# EAGLE design master (EAGLE 6.6.0)
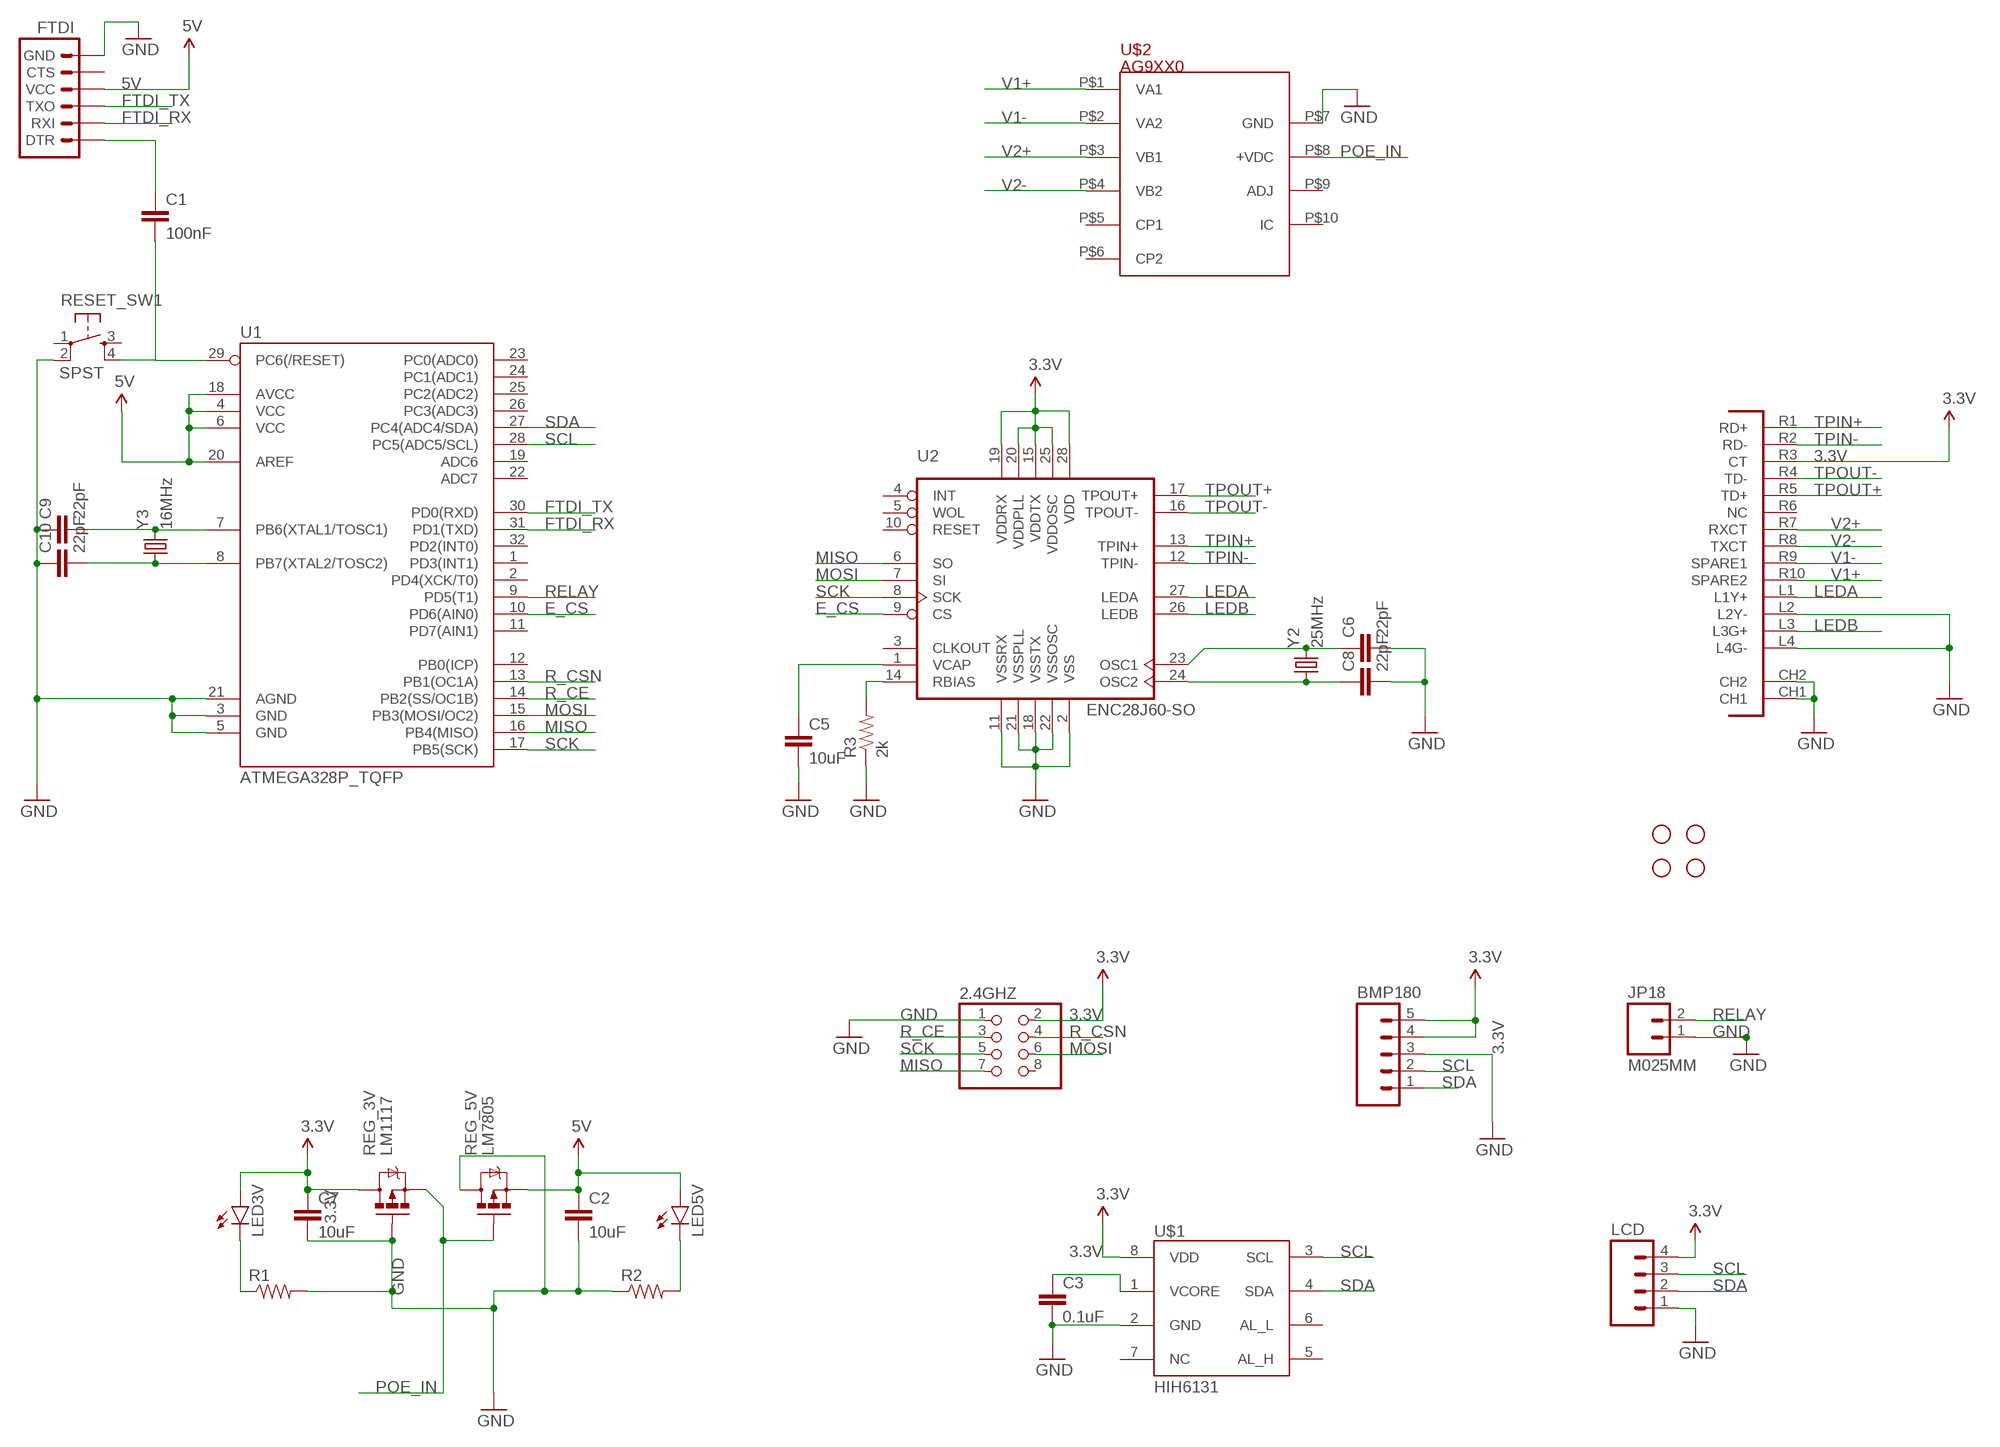
[diagram p0: schematic, sheet 1]

## Parts
2.4GHZ  PINHD-2X4  [2X04]
BMP180  M05PTH  [1X05]
C1  100nF  CAPPTH  [CAP-PTH-SMALL]
C2  10uF  CAPPTH  [CAP-PTH-SMALL]
C3  0.1uF  CAPPTH  [CAP-PTH-SMALL]
C5  10uF  CAPPTH  [CAP-PTH-SMALL]
C6  22pF  CAPPTH  [CAP-PTH-SMALL]
C7  10uF  CAPPTH  [CAP-PTH-SMALL]
C8  22pF  CAPPTH  [CAP-PTH-SMALL]
C9  22pF  CAPPTH  [CAP-PTH-SMALL]
C10  22pF  CAPPTH  [CAP-PTH-SMALL]
FTDI  ARDUINO_SERIAL_PROGRAMPTH  [1X06]
JP18  M025MM  [SCREWTERMINAL-5MM-2]
LCD  M04PTH  [1X04]
LED3V  LED3MM  [LED3MM]
LED5V  LED3MM  [LED3MM]
R1  RESISTORPTH-1/4W-VERT  [AXIAL-0.1]
R2  RESISTORPTH-1/4W-VERT  [AXIAL-0.1]
R3  2k  RESISTORPTH-1/4W-VERT  [AXIAL-0.1]
REG_3V  LM1117  MOSFET-PCHANNELFQP27P06  [TO220V]
REG_5V  LM7805  MOSFET-PCHANNELFQP27P06  [TO220V]
RESET_SW1  SPST  TACTILE-SWITCH-PTH  [TAC-SWITCH-PTH]
STANDOFF1  STAND-OFF  [STAND-OFF]
STANDOFF2  STAND-OFF  [STAND-OFF]
STANDOFF3  STAND-OFF  [STAND-OFF]
STANDOFF4  STAND-OFF  [STAND-OFF]
U1  ATMEGA328P_TQFP  [TQFP32-08]
U2  ENC28J60-SO  [SO28W]
U$1  HIH6131  [SOIC8]
U$2  AG9XX0  [AG9000]
U$3  POE-RJ45  [POE-RJ45]
Y2  25MHz  CRYSTALHC49US  [HC49US]
Y3  16MHz  CRYSTALHC49US  [HC49US]

## Nets
3.3V: 2.4GHZ.2 BMP180.4 BMP180.5 C7.1 LCD.4 LED3V.A REG_3V.2(D) U2.15(VDDTX) U2.19(VDDRX) U2.20(VDDPLL) U2.25(VDDOSC) U2.28(VDD) U$1.8(VDD) U$3.R3(CT)
5V: C2.1 FTDI.4(VCC) LED5V.A REG_5V.3(S) U1.4(VCC) U1.6(VCC) U1.18(AVCC) U1.20(AREF)
E_CS: U1.10(PD6(AIN0)) U2.9(CS)
FTDI_RX: FTDI.2(RXI) U1.31(PD1(TXD))
FTDI_TX: FTDI.3(TXO) U1.30(PD0(RXD))
GND: 2.4GHZ.1 BMP180.3 C2.2 C3.2 C5.2 C6.2 C7.2 C8.2 C9.1 C10.1 FTDI.6(GND) JP18.1 LCD.1 R1.P$2 R2.P$1 R3.P$1 REG_3V.1(G) REG_5V.2(D) RESET_SW1.2 U1.3(GND) U1.5(GND) U1.21(AGND) U2.2(VSS) U2.11(VSSRX) U2.18(VSSTX) U2.21(VSSPLL) U2.22(VSSOSC) U$1.2(GND) U$2.P$7(GND) U$3.CH1 U$3.CH2 U$3.L2(L2Y-) U$3.L4(L4G-)
LEDA: U2.27(LEDA) U$3.L1(L1Y+)
LEDB: U2.26(LEDB) U$3.L3(L3G+)
MISO: 2.4GHZ.7 U1.16(PB4(MISO)) U2.6(SO)
MOSI: 2.4GHZ.6 U1.15(PB3(MOSI/OC2)) U2.7(SI)
N$1: LED3V.K(C) R1.P$1
N$2: LED5V.K(C) R2.P$2
N$3: R3.P$2 U2.14(RBIAS)
N$4: C5.1 U2.1(VCAP)
N$5: C6.1 U2.23(OSC1) Y2.2
N$6: C8.1 U2.24(OSC2) Y2.1
N$17: C3.1 U$1.1(VCORE)
N$20: C9.2 U1.7(PB6(XTAL1/TOSC1)) Y3.2
N$21: C10.2 U1.8(PB7(XTAL2/TOSC2)) Y3.1
N$37: C1.1 FTDI.1(DTR)
POE_IN: REG_3V.3(S) REG_5V.1(G) U$2.P$8(+VDC)
R_CE: 2.4GHZ.3 U1.14(PB2(SS/OC1B))
R_CSN: 2.4GHZ.4 U1.13(PB1(OC1A))
RELAY: JP18.2 U1.9(PD5(T1))
RESET: C1.2 RESET_SW1.4 U1.29(PC6(/RESET))
SCK: 2.4GHZ.5 U1.17(PB5(SCK)) U2.8(SCK)
SCL: BMP180.2 LCD.3 U1.28(PC5(ADC5/SCL)) U$1.3(SCL)
SDA: BMP180.1 LCD.2 U1.27(PC4(ADC4/SDA)) U$1.4(SDA)
TPIN+: U2.13(TPIN+) U$3.R1(RD+)
TPIN-: U2.12(TPIN-) U$3.R2(RD-)
TPOUT+: U2.17(TPOUT+) U$3.R5(TD+)
TPOUT-: U2.16(TPOUT-) U$3.R4(TD-)
V1+: U$2.P$1(VA1) U$3.R10(SPARE2)
V1-: U$2.P$2(VA2) U$3.R9(SPARE1)
V2+: U$2.P$3(VB1) U$3.R7(RXCT)
V2-: U$2.P$4(VB2) U$3.R8(TXCT)
Unconnected: 2.4GHZ.8 FTDI.5(CTS) RESET_SW1.1 RESET_SW1.3 U1.1(PD3(INT1)) U1.2(PD4(XCK/T0)) U1.11(PD7(AIN1)) U1.12(PB0(ICP)) U1.19(ADC6) U1.22(ADC7) U1.23(PC0(ADC0)) U1.24(PC1(ADC1)) U1.25(PC2(ADC2)) U1.26(PC3(ADC3)) U1.32(PD2(INT0)) U2.3(CLKOUT) U2.4(INT) U2.5(WOL) U2.10(RESET) U$1.5(AL_H) U$1.6(AL_L) U$1.7(NC) U$2.P$5(CP1) U$2.P$6(CP2) U$2.P$9(ADJ) U$2.P$10(IC) U$3.R6(NC)

## Library data of the parts
2.4GHZ = adafruit:PINHD-2X4: PIN HEADER
BMP180 = SparkFun-Connectors:M05: Header 5 Standard 5-pin 0.1" header. Use with straight break away headers (SKU : PRT-00116), right angle break away headers (PRT-00553), swiss pins (PRT-00743), machine pins (PRT-00117), and female headers (PRT-00115). Molex polarized connector foot print use with SKU : PRT-08230 with associated crimp pins and housings.
C1-C3 C5-C10 = SparkFun-Capacitors:CAP: Capacitor Standard 0603 ceramic capacitor, and 0.1" leaded capacitor.
FTDI = SparkFun-Connectors:ARDUINO_SERIAL_PROGRAM: FTDI connector footprints
JP18 = SparkFun-Connectors:M02: Standard 2-pin 0.1" header. Use with - straight break away headers ( PRT-00116) - right angle break away headers (PRT-00553) - swiss pins (PRT-00743) - machine pins (PRT-00117) - female headers (PRT-00115) Molex polarized connector foot print use with: PRT-08233 with associated crimp pins and housings. 2.54_SCREWTERM for use with PRT-10571. 3.5mm Screw Terminal footprints for PRT-08084 5mm Screw Terminal footprints for use with PRT-08432; STOREFRONT_ID: PRT-08432
LCD = SparkFun-Connectors:M04: Header 4 Standard 4-pin 0.1" header. Use with straight break away headers (SKU : PRT-00116), right angle break away headers (PRT-00553), swiss pins (PRT-00743), machine pins (PRT-00117), and female headers (PRT-00115). Molex polarized connector foot print use with SKU : PRT-08231 with associated crimp pins and housings. 1MM SMD Version SKU: PRT-10208
LED3V LED5V = SparkFun-LED:LED: LEDs Standard schematic elements and footprints for 5mm, 3mm, 1206, and 0603 sized LEDs. 5mm - Spark Fun Electronics SKU : COM-00529 (and others)
R1-R3 = SparkFun-Resistors:RESISTOR: Resistor Basic schematic elements and footprints for 0603, 1206, and PTH resistors.
REG_3V REG_5V = User-Submitted:MOSFET-PCHANNEL: Generic PMOSFET IRLML2244 - TRANS-11153 (SOT-23 -20V -4.3A) (1.Gate 2.Source 3.Drain) FQP27P06 - COM-10349 <http://www.sparkfun.com/products/10349> (TO-220 -60V -27A) (1.Gate 2.Source 3.Drain)
RESET_SW1 = GeekAmmo:TACTILE-SWITCH: Tactile Switch 4 Pins, SPST NO
STANDOFF1-STANDOFF4 = SparkFun-Electromechanical:STAND-OFF: #4 Stand Off This is the mechanical footprint for a #4 phillips button head screw. Use the keepout ring to avoid running the screw head into surrounding components. SKU : PRT-00447
U1 = SparkFun-DigitalIC:ATMEGA328P_TQFP; PROD_ID: IC-09069
U2 = microchip-enc28j60:ENC28J60-*: Microchip 10Mbit Eth. contoller with SPI interface
U$1 = SparkFun-AnalogIC:HIH6131
U$2 = SmartPrj:AG9XX0: PoE module
U$3 = SmartPrj:POE-RJ45
Y2 Y3 = SparkFun-FreqCtrl:CRYSTAL: Various standard crystals. Proven footprints.

## Board
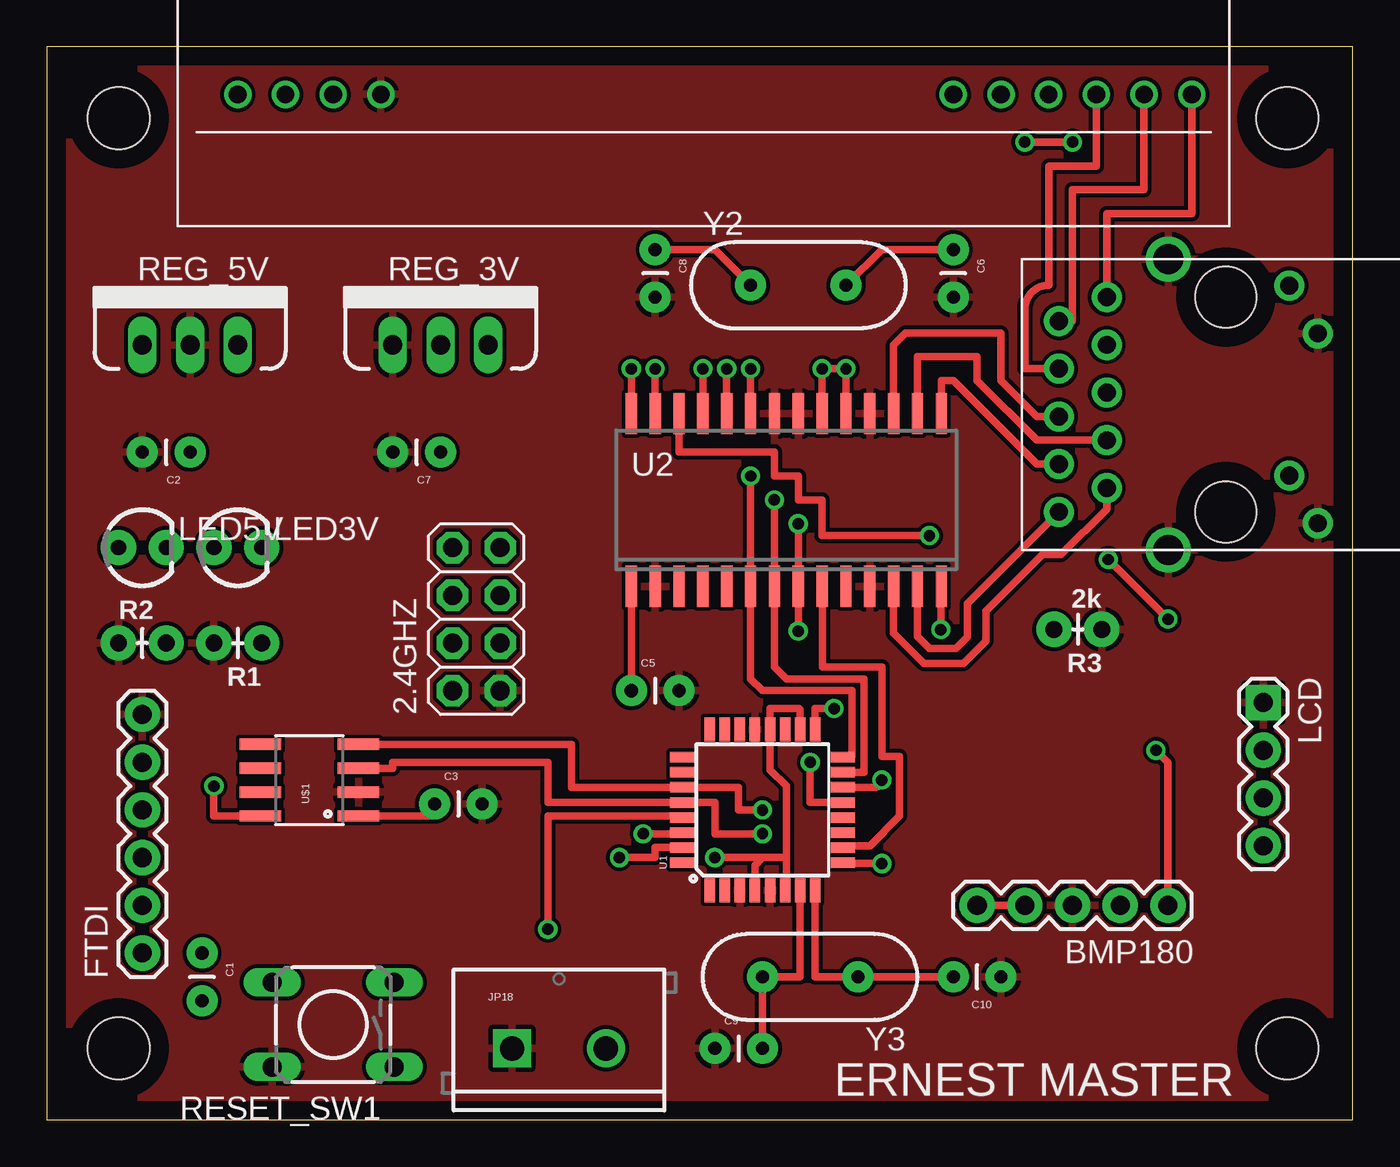
[diagram p1: board, top side]
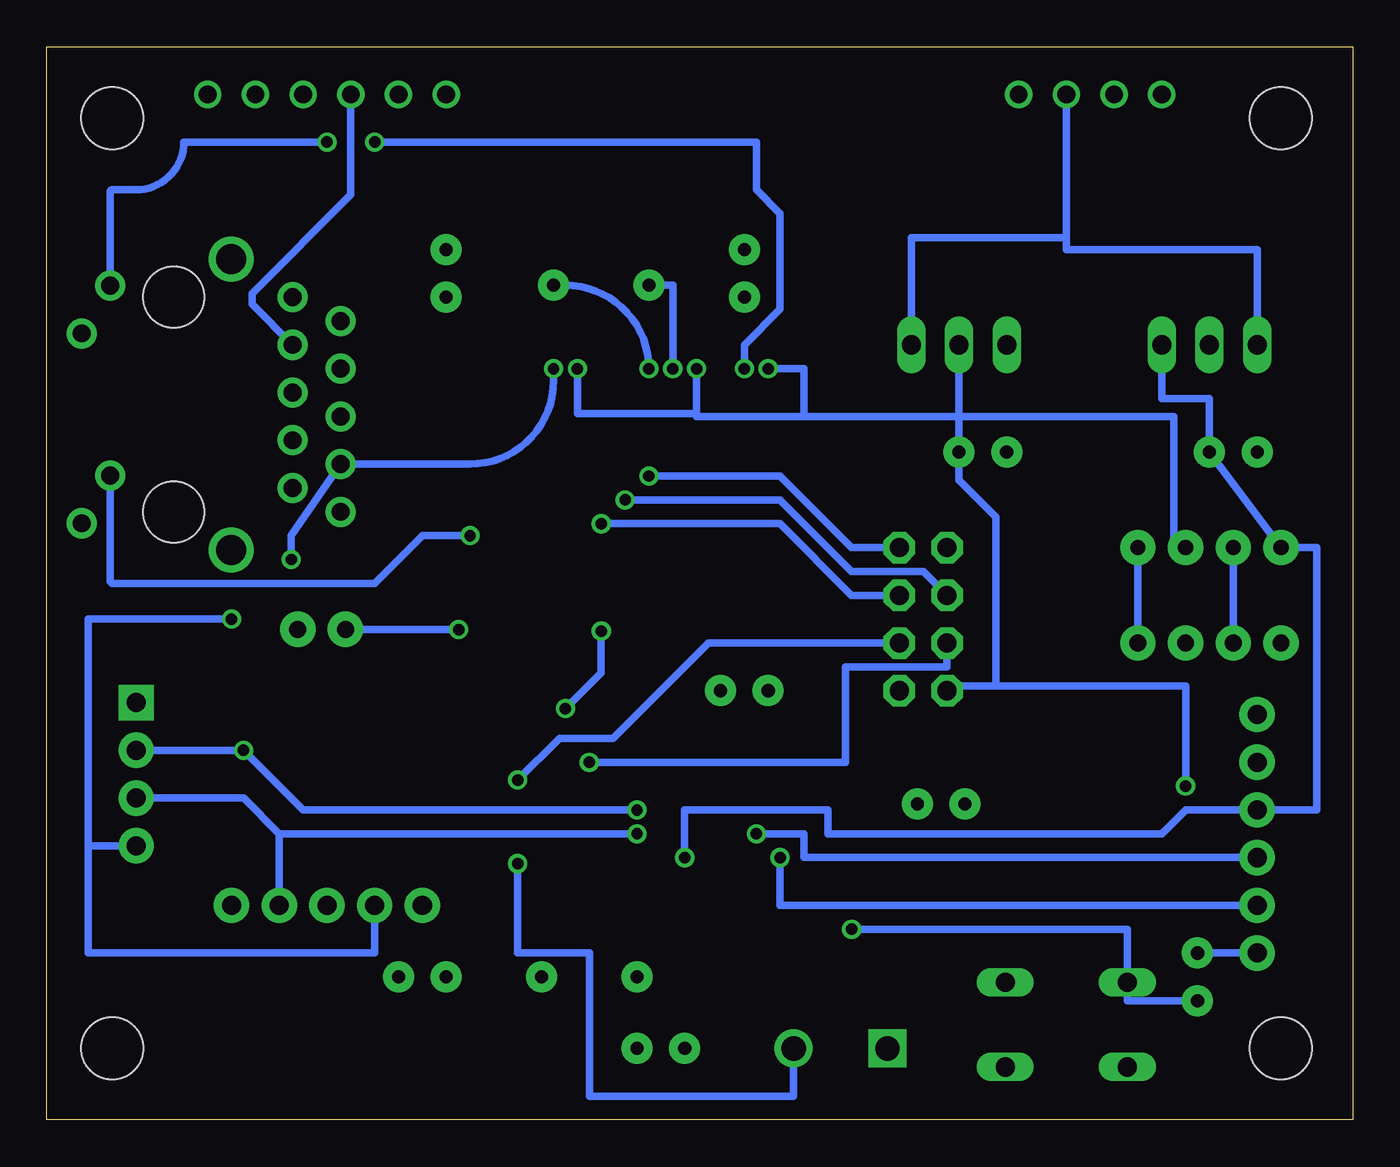
[diagram p2: board, bottom side, seen from below]

Size 69.52 x 57.14 mm. Coordinates in mm from the lower left corner, seen from the top.
Outline: 0,0 69.52,0 69.52,57.14 0,57.14 0,0
Copper layers (1*16): Top 0.035mm / dielectric 1.5mm / Bottom 0.035mm
Design rules "default": minimum track width 10mil, minimum drill 24mil, track to track 8mil, track to pad 8mil, pad to pad 8mil, via to via 8mil, smd to smd 8mil, copper to edge 40mil, drill to drill 8mil, minimum pad ring 10mil, minimum via ring 8mil, stop-mask expansion 4mil, vias tented up to drill 0mil, thermal gap 10mil

### Footprints (pad centres in the part's own frame; a part is rotated, then mirrored left to right if it is on the bottom)
2X04 = drill 1.016 pad 1.676 octagon: 1 -3.81,-1.27; 2 -3.81,1.27; 3 -1.27,-1.27; 4 -1.27,1.27; 5 1.27,-1.27; 6 1.27,1.27; 7 3.81,-1.27; 8 3.81,1.27
1X05 = drill 1.016 pad 1.88: 1 0,0; 2 2.54,0; 3 5.08,0; 4 7.62,0; 5 10.16,0
CAP-PTH-SMALL = drill 0.7 pad 1.651: 1 0,0; 2 2.54,0
1X06 = drill 1.016 pad 1.88: 1 0,0; 2 2.54,0; 3 5.08,0; 4 7.62,0; 5 10.16,0; 6 12.7,0
SCREWTERMINAL-5MM-2 = drill 1.3 pad 2.032 square: 1 0,0 | drill 1.3 pad 2.032: 2 5,0
1X04 = drill 1.016 pad 1.88 square: 1 0,0 | drill 1.016 pad 1.88: 2 2.54,0; 3 5.08,0; 4 7.62,0
LED3MM = drill 0.813 pad 1.88: A -1.27,0; K 1.27,0
AXIAL-0.1 = drill 0.9 pad 1.88: P$1 0,0; P$2 2.54,0
TO220V = drill 1.016 long: 1 -2.54,0; 2 0,0; 3 2.54,0
TAC-SWITCH-PTH = drill 1.016 pad 1.524 long: 1 -3.251,2.261; 2 3.251,2.261; 3 -3.251,-2.261; 4 3.251,-2.261
STAND-OFF = hole 3.302: 0,0
TQFP32-08 = smd 1.27 x 0.559: 1 -4.293,2.8; 2 -4.293,2; 3 -4.293,1.2; 4 -4.293,0.4; 5 -4.293,-0.4; 6 -4.293,-1.2; 7 -4.293,-2; 8 -4.293,-2.8; 17 4.293,-2.8; 18 4.293,-2; 19 4.293,-1.2; 20 4.293,-0.4; 21 4.293,0.4; 22 4.293,1.2; 23 4.293,2; 24 4.293,2.8 | smd 0.559 x 1.27: 9 -2.8,-4.293; 10 -2,-4.293; 11 -1.2,-4.293; 12 -0.4,-4.293; 13 0.4,-4.293; 14 1.2,-4.293; 15 2,-4.293; 16 2.8,-4.293; 25 2.8,4.293; 26 2,4.293; 27 1.2,4.293; 28 0.4,4.293; 29 -0.4,4.293; 30 -1.2,4.293; 31 -2,4.293; 32 -2.8,4.293
SO28W = smd 0.6 x 2.2: 1 -8.255,-4.6; 2 -6.985,-4.6; 3 -5.715,-4.6; 4 -4.445,-4.6; 5 -3.175,-4.6; 6 -1.905,-4.6; 7 -0.635,-4.6; 8 0.635,-4.6; 9 1.905,-4.6; 10 3.175,-4.6; 11 4.445,-4.6; 12 5.715,-4.6; 13 6.985,-4.6; 14 8.255,-4.6; 15 8.255,4.6; 16 6.985,4.6; 17 5.715,4.6; 18 4.445,4.6; 19 3.175,4.6; 20 1.905,4.6; 21 0.635,4.6; 22 -0.635,4.6; 23 -1.905,4.6; 24 -3.175,4.6; 25 -4.445,4.6; 26 -5.715,4.6; 27 -6.985,4.6; 28 -8.255,4.6
SOIC8 = smd 0.61 x 2.21: 1 -1.905,-2.616; 2 -0.635,-2.616; 3 0.635,-2.616; 4 1.905,-2.616; 5 1.905,2.616; 6 0.635,2.616; 7 -0.635,2.616; 8 -1.905,2.616
AG9000 = drill 0.95 pad 1.422: P$1 0,0; P$2 2.54,0; P$3 5.08,0; P$4 7.62,0; P$5 10.16,0; P$6 12.7,0; P$7 43.18,0; P$8 45.72,0; P$9 48.26,0; P$10 50.8,0
POE-RJ45 = drill 1.6: CH1 13.94,7.75; CH2 13.94,-7.75 | drill 0.95 pad 1.6: L1 7.51,-6.325; L2 5.99,-3.785; L3 7.51,3.785; L4 5.99,6.325; R1 19.77,5.715; R2 17.23,4.445; R3 19.77,3.175; R4 17.23,1.905; R5 19.77,0.635; R6 17.23,-0.635; R7 19.77,-1.905; R8 17.23,-3.175; R9 19.77,-4.445; R10 17.23,-5.715 | hole 3.25: 10.89,5.715; 10.89,-5.715
HC49US = drill 0.7 pad 1.651: 1 -2.54,0; 2 2.54,0

### Placement (x,y rotation side)
2.4GHZ  22.86,26.67 90 top
BMP180  59.69,11.43 180 top
C1  8.26,8.89 270 top
C2  7.62,35.56 180 top
C3  20.64,16.83 0 top
C5  31.11,22.86 0 top
C6  48.26,46.35 270 top
C7  20.95,35.56 180 top
C8  32.38,46.35 270 top
C9  35.56,3.81 0 top
C10  50.8,7.62 180 top
FTDI  5.08,8.89 90 top
JP18  24.77,3.81 0 top
LCD  64.77,22.22 270 top
LED3V  10.16,30.48 0 top
LED5V  5.08,30.48 0 top
R1  11.43,25.4 180 top
R2  3.81,25.4 0 top
R3  56.16,26.13 180 top
REG_3V  20.95,41.27 0 top
REG_5V  7.62,41.27 0 top
RESET_SW1  15.24,5.08 180 top
STANDOFF1  3.81,53.34 0 top
STANDOFF2  3.81,3.81 0 top
STANDOFF3  66.04,3.81 0 top
STANDOFF4  66.04,53.34 0 top
U1  38.1,16.51 90 top
U2  39.37,33.02 0 top
U$1  13.97,18.1 90 top
U$2  60.96,54.61 180 top
U$3  73.66,38.1 180 top
Y2  40.01,44.45 0 top
Y3  40.64,7.62 180 top

### Tracks (layer width: path | path; a pad name or v marks a point on that pad's centre or on a via)
3.3V  (via drill 0.61)
  Top 0.406: BMP180.5 BMP180.4 | v56.52,29.84 v59.69,26.67 | U$3.R3 52.7,34.92 48.26,39.37 47.62,39.37 U2.15 | U2.28 v31.11,40.01 | U2.25 v34.92,40.01 | U2.20 v41.27,40.01 v42.55,40.01 U2.19 | U$1.8 8.89,16.19 v8.89,17.78
  Bottom 0.406: REG_3V.2 20.95,37.46 | 20.95,37.46 C7.1 20.95,34.06 19,32.11 19,23.11 | 20.95,37.46 9.53,37.46 9.53,30.48 LED3V.A | 67.31,14.61 67.31,26.67 v59.69,26.67 | 19,23.11 21.34,23.11 2.4GHZ.2 | v56.52,29.84 56.52,31.12 U$3.R3 46.99,34.92 arc-90 42.55,39.37 v42.55,40.01 | 20.95,37.46 29.21,37.46 | 29.21,37.46 29.21,40.01 v31.11,40.01 | v34.92,40.01 U2.25 | U2.25 34.92,37.46 29.21,37.46 | v41.27,40.01 U2.20 U2.25 | LCD.4 67.31,14.61 | BMP180.4 52.07,8.89 67.31,8.89 67.31,14.61 | 19,23.11 8.89,23.11 v8.89,17.78
5V  (via drill 0.61)
  Top 0.406: U1.18 40.1,21.81 arc90 40.01,21.91 38.5,21.91 U1.20 38.5,18.65 39.37,17.78 39.37,13.97 | 39.37,13.97 39.37,12.29 U1.6 | U1.4 37.7,13.57 38.1,13.97 | 38.1,13.97 39.37,13.97 | v35.56,13.97 38.1,13.97
  Bottom 0.406: v35.56,13.97 35.56,16.51 27.94,16.51 27.94,15.24 10.16,15.24 8.89,16.51 FTDI.4 1.91,16.51 1.91,30.48 LED5V.A C2.1 7.62,38.42 10.16,38.42 REG_5V.3
E_CS
  Top 0.406: U2.9 41.3,28.39 41.3,24.13 44.45,24.13 44.45,19.37 45.4,19.37 45.4,16.19 43.81,14.61 42.49,14.61 U1.10
FTDI_RX  (via drill 0.61)
  Top 0.406: U1.31 32.38,14.51 32.38,13.97 v30.48,13.97
  Bottom 0.406: FTDI.2 30.48,11.43 v30.48,13.97
FTDI_TX  (via drill 0.61)
  Top 0.406: v31.75,15.24 33.81,15.24 U1.30
  Bottom 0.406: FTDI.3 29.21,13.97 29.21,15.24 v31.75,15.24
GND
  pour Top: 0,0 69.85,0 69.85,57.15 0,57.15
LEDA  (via drill 0.61)
  Top 0.406: U2.27 v32.38,40.01 | v52.07,52.07 v54.61,52.07
  Bottom 0.406: v32.38,40.01 32.38,41.27 30.48,43.18 30.48,48.26 31.75,49.53 31.75,52.07 v52.07,52.07 | v54.61,52.07 62.23,52.07 arc90 64.77,49.53 66.04,49.53 arc-90 66.15,49.42 U$3.L1
LEDB  (via drill 0.61)
  Top 0.406: U2.26 33.66,35.56 38.73,35.56 38.73,34.29 40.01,34.29 40.01,33.02 41.27,33.02 41.27,31.12 v46.99,31.12
  Bottom 0.406: v46.99,31.12 49.53,31.12 52.07,28.58 66.04,28.58 66.15,28.69 U$3.L3
MISO  (via drill 0.61)
  Top 0.406: v37.47,34.29 U2.6 37.47,23.49 38.1,22.86 42.86,22.86 42.86,19.37 42.39,19.37 U1.16
  Bottom 0.406: 2.4GHZ.7 26.67,30.48 30.48,34.29 v37.47,34.29
MOSI  (via drill 0.61)
  Top 0.406: v38.73,33.02 U2.7 38.73,24.13 39.37,23.49 43.5,23.49 43.5,18.51 U1.15
  Bottom 0.406: 2.4GHZ.6 22.86,29.21 26.67,29.21 30.48,33.02 v38.73,33.02
N$1
  Bottom 0.406: LED3V.K R1.P$1
N$2
  Bottom 0.406: LED5V.K R2.P$2
N$3  (via drill 0.61)
  Top 0.406: U2.14 47.6,28.42 v47.6,26.11
  Bottom 0.406: v47.6,26.11 53.6,26.11 R3.P$2
N$4
  Top 0.406: C5.1 U2.1
N$5  (via drill 0.61)
  Top 0.406: C6.1 44.45,46.35 Y2.2 | v37.47,40.01 U2.23
  Bottom 0.406: Y2.2 41.91,44.45 arc90 v37.47,40.01
N$6  (via drill 0.61)
  Top 0.406: C8.1 35.56,46.35 Y2.1 | v36.2,40.01 U2.24
  Bottom 0.406: Y2.1 36.2,44.45 v36.2,40.01
N$17
  Top 0.406: U$1.1 20.64,16.19 C3.1
N$20
  Top 0.406: U1.7 40.1,7.62 Y3.2 C9.2
N$21
  Top 0.406: C10.2 Y3.1 40.9,7.62 U1.8
N$37
  Bottom 0.406: FTDI.1 C1.1
POE_IN
  Bottom 0.406: U$2.P$8 15.24,46.99 | 15.24,46.99 15.24,46.35 5.08,46.35 REG_5V.1 | REG_3V.3 23.5,46.99 15.24,46.99
R_CE  (via drill 0.61)
  Top 0.406: U1.14 44.06,17.71 arc90 v44.45,18.1
  Bottom 0.406: 2.4GHZ.3 34.29,25.4 39.37,20.32 42.23,20.32 v44.45,18.1
R_CSN  (via drill 0.61)
  Top 0.406: U1.13 40.64,16.91 v40.64,19.05
  Bottom 0.406: 2.4GHZ.4 21.6,24.11 27,24.11 27,19.05 v40.64,19.05
RELAY  (via drill 0.61)
  Top 0.406: v44.45,13.65 42.39,13.65 U1.9
  Bottom 0.406: v44.45,13.65 44.45,8.89 40.64,8.89 40.64,1.27 29.77,1.27 JP18.2
RESET  (via drill 0.61)
  Top 0.406: U1.29 33.73,16.19 26.67,16.19 v26.67,10.16
  Bottom 0.406: C1.2 11.99,6.35 RESET_SW1.4 11.99,10.16 v26.67,10.16
SCK  (via drill 0.61)
  Top 0.406: v40.01,31.75 U2.8 v40.01,26.03 | U1.17 40.9,21.91 v41.91,21.91
  Bottom 0.406: 2.4GHZ.5 26.67,27.94 30.48,31.75 v40.01,31.75 | v41.91,21.91 40.01,23.81 v40.01,26.03
SCL  (via drill 0.61)
  Top 0.406: v38.1,15.24 35.56,15.24 35.56,16.91 U1.28 26.67,16.91 26.67,19.05 18.41,19.05 18.41,18.73 U$1.3
  Bottom 0.406: v38.1,15.24 57.15,15.24 | 57.15,15.24 59.05,17.14 LCD.3 | 57.15,15.24 BMP180.2
SDA  (via drill 0.61)
  Top 0.406: v38.1,16.51 36.83,16.51 36.83,17.71 U1.27 27.94,17.71 27.94,20 U$1.4 | BMP180.1 59.69,19.05 v59.05,19.68
  Bottom 0.406: v38.1,16.51 55.88,16.51 v59.05,19.68 LCD.2
TPIN+
  Top 0.406: U2.13 46.35,25.76 47,25.11 48.4,25.11 49,25.71 49,27.49 U$3.R1
TPIN-
  Top 0.406: U2.12 45.09,25.92 46.7,24.31 48.8,24.31 50,25.51 50,27.11 53,30.11 54,30.11 56.43,32.54 U$3.R2
TPOUT+
  Top 0.406: U$3.R5 52.7,37.46 50.8,39.37 50.8,41.91 45.72,41.91 45.09,41.27 U2.17
TPOUT-
  Top 0.406: U$3.R4 52.7,36.2 49.53,39.37 49.53,40.64 46.35,40.64 U2.16
V1+
  Top 0.406: U$2.P$1 60.96,48.26 56.43,48.26 U$3.R10
V1-
  Top 0.406: U$2.P$2 58.42,49.53 54.61,49.53 54.61,42.55 U$3.R9
V2+
  Top 0.406: U$2.P$3 55.88,50.8 53.34,50.8 53.34,44.45 arc90 52.07,43.18 52.07,40.01 U$3.R7
V2-
  Bottom 0.406: U$2.P$4 53.34,49.27 58.6,44.01 58.6,43.45 U$3.R8

### Text on the board
_tsilk: ERNEST MASTER